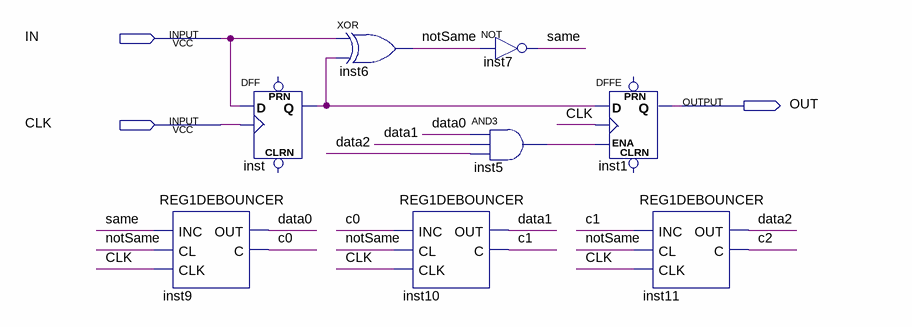
[diagram p0: schematic sheet]
// Quartus schematic Debouncer.bdf as structural Verilog: 8 symbols, 3 pins
module Debouncer (
  input  IN,
  input  CLK,
  output OUT
);

  wire c0, c1, c2, data0, data1, data2, inst5_out, inst_q, notSame, same;

  REG1DEBOUNCER inst9 (.INC(same), .CL(notSame), .CLK(CLK), .OUT(data0), .C(c0));
  DFF inst (.CLK(CLK), .D(IN), .Q(inst_q));  // open: CLRN, PRN
  xor inst6 (notSame, IN, inst_q);
  REG1DEBOUNCER inst10 (.INC(c0), .CL(notSame), .CLK(CLK), .OUT(data1), .C(c1));
  not inst7 (same, notSame);
  and inst5 (inst5_out, data0, data1, data2);
  DFFE inst1 (.D(inst_q), .CLK(CLK), .ENA(inst5_out), .Q(OUT));  // open: PRN, CLRN
  REG1DEBOUNCER inst11 (.INC(c1), .CL(notSame), .CLK(CLK), .OUT(data2), .C(c2));
endmodule
